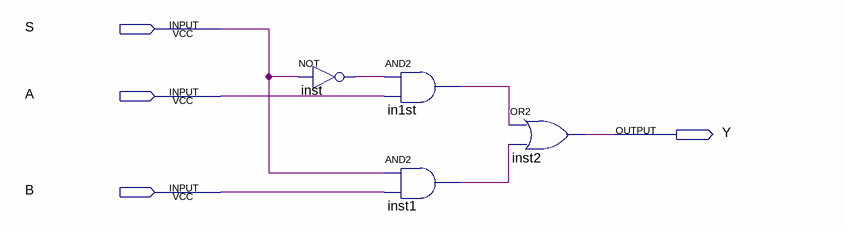
[diagram p0: schematic sheet]
// Quartus schematic MUX2TO1.bdf as structural Verilog: 4 symbols, 4 pins
module MUX2TO1 (
  input  S,
  input  A,
  input  B,
  output Y
);

  wire in1st_out, inst1_out, inst_out;

  not inst (inst_out, S);
  and in1st (in1st_out, inst_out, A);
  and inst1 (inst1_out, S, B);
  or inst2 (Y, in1st_out, inst1_out);
endmodule
